# EAGLE design Rotary_Alps_D (EAGLE 9.6.2)
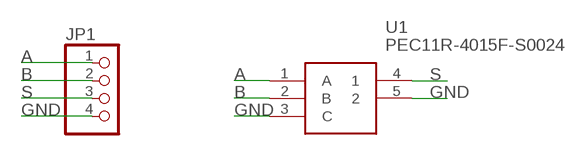
[diagram p0: schematic, sheet 1]

## Parts
JP1  PINHD-1X4  [1X04]
U1  PEC11R-4015F-S0024  [PEC12R-4XXXF-SXXXX_1]

## Nets
A: JP1.1 U1.1(A)
B: JP1.2 U1.2(B)
GND: JP1.4 U1.3(C) U1.5
S: JP1.3 U1.4

## Library data of the parts
JP1 = pinhead:PINHD-1X4: PIN HEADER
U1 = SamacSys_Parts:PEC11R-4015F-S0024: Bourns 24 Pulse Incremental Mechanical Rotary Encoder with a 6 mm Flat Shaft (Not Indexed), Through Hole Source: Datasheet <https://www.bourns.com/docs/Product-Datasheets/pec11R.pdf>; DESCRIPTION: Bourns 24 Pulse Incremental Mechanical Rotary Encoder with a 6 mm Flat Shaft (Not Indexed), Through Hole; HEIGHT: mm; MANUFACTURER_NAME: Bourns; MANUFACTURER_PART_NUMBER: PEC11R-4015F-S0024; MOUSER_PART_NUMBER: 652-PEC11R-4015F-S24; MOUSER_PRICE-STOCK: https://www.mouser.co.uk/ProductDetail/Bourns/PEC11R-4015F-S0024?qs=Zq5ylnUbLm4l0nvCUCX4Xw%3D%3D

## Board
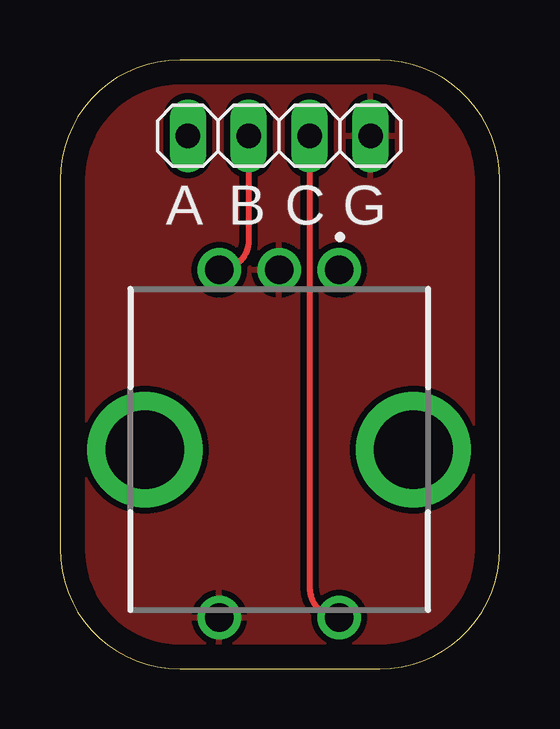
[diagram p1: board, top side]
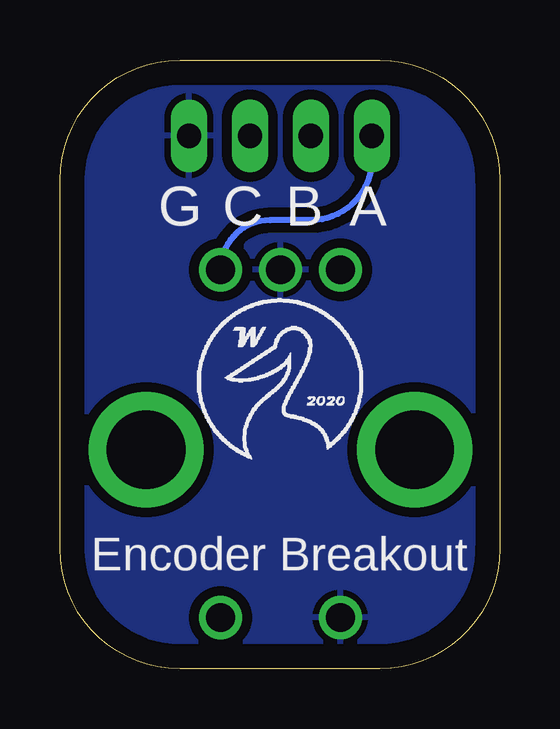
[diagram p2: board, bottom side, seen from below]

Size 18.34 x 25.39 mm. Coordinates in mm from the lower left corner, seen from the top.
Outline: 0,20.39 0,5 arc90 5,0 13.34,0 arc90 18.34,5 18.34,20.39 arc90 13.34,25.39 5,25.39 arc90 0,20.39
Copper layers (1*16): Top 0.035mm / dielectric 1.5mm / Bottom 0.035mm
Design rules "default": minimum track width 6mil, minimum drill 0.35mm, track to track 6mil, track to pad 6mil, pad to pad 6mil, via to via 6mil, smd to smd 6mil, copper to edge 40mil, drill to drill 6mil, minimum pad ring 10mil, minimum via ring 8mil, stop-mask expansion 4mil, vias tented up to drill 0mil, thermal gap 10mil

### Footprints (pad centres in the part's own frame; a part is rotated, then mirrored left to right if it is on the bottom)
1X04 = drill 1.016 long: 1 -3.81,0; 2 -1.27,0; 3 1.27,0; 4 3.81,0
PEC12R-4XXXF-SXXXX_1 = drill 1.2 pad 1.8: 1 -2.5,-7.5; 2 2.5,-7.5; 3 0,-7.5; 4 -2.5,7; 5 2.5,7 | drill 3.28 pad 4.8: 6 5.6,0; 7 -5.6,0

### Placement (x,y rotation side)
JP1  9.14,22.23 0 top
U1  9.14,9.14 180 top

### Tracks (layer width: path | path; a pad name or v marks a point on that pad's centre or on a via)
A
  Bottom 0.254: JP1.1 5.33,21.25 arc90 7.87,18.71 9.58,18.71 arc-90 U1.1
B
  Top 0.254: JP1.2 7.87,17.87 arc-90 U1.2
GND
  pour Bottom (isolate 0.406): 15.06,25.2 arc-90 18.16,22.1 18.16,2.92 arc-90 15.49,0.25 2.67,0.25 arc-90 0.25,2.67 0.25,22.35 arc-90 3.1,25.2 15.06,25.2
  pour Top (isolate 0.254): 2.08,25.15 16.54,25.15 17.96,23.72 17.96,1.45 16.99,0.48 1.42,0.48 0.23,1.68 0.23,23.29
S
  Top 0.254: JP1.3 10.41,3.37 arc90 U1.4

### Text on the board
tPlace: A | B | C | G
bPlace: A | B | C | G | Encoder Breakout